# EAGLE design dac2 (EAGLE 5.06)
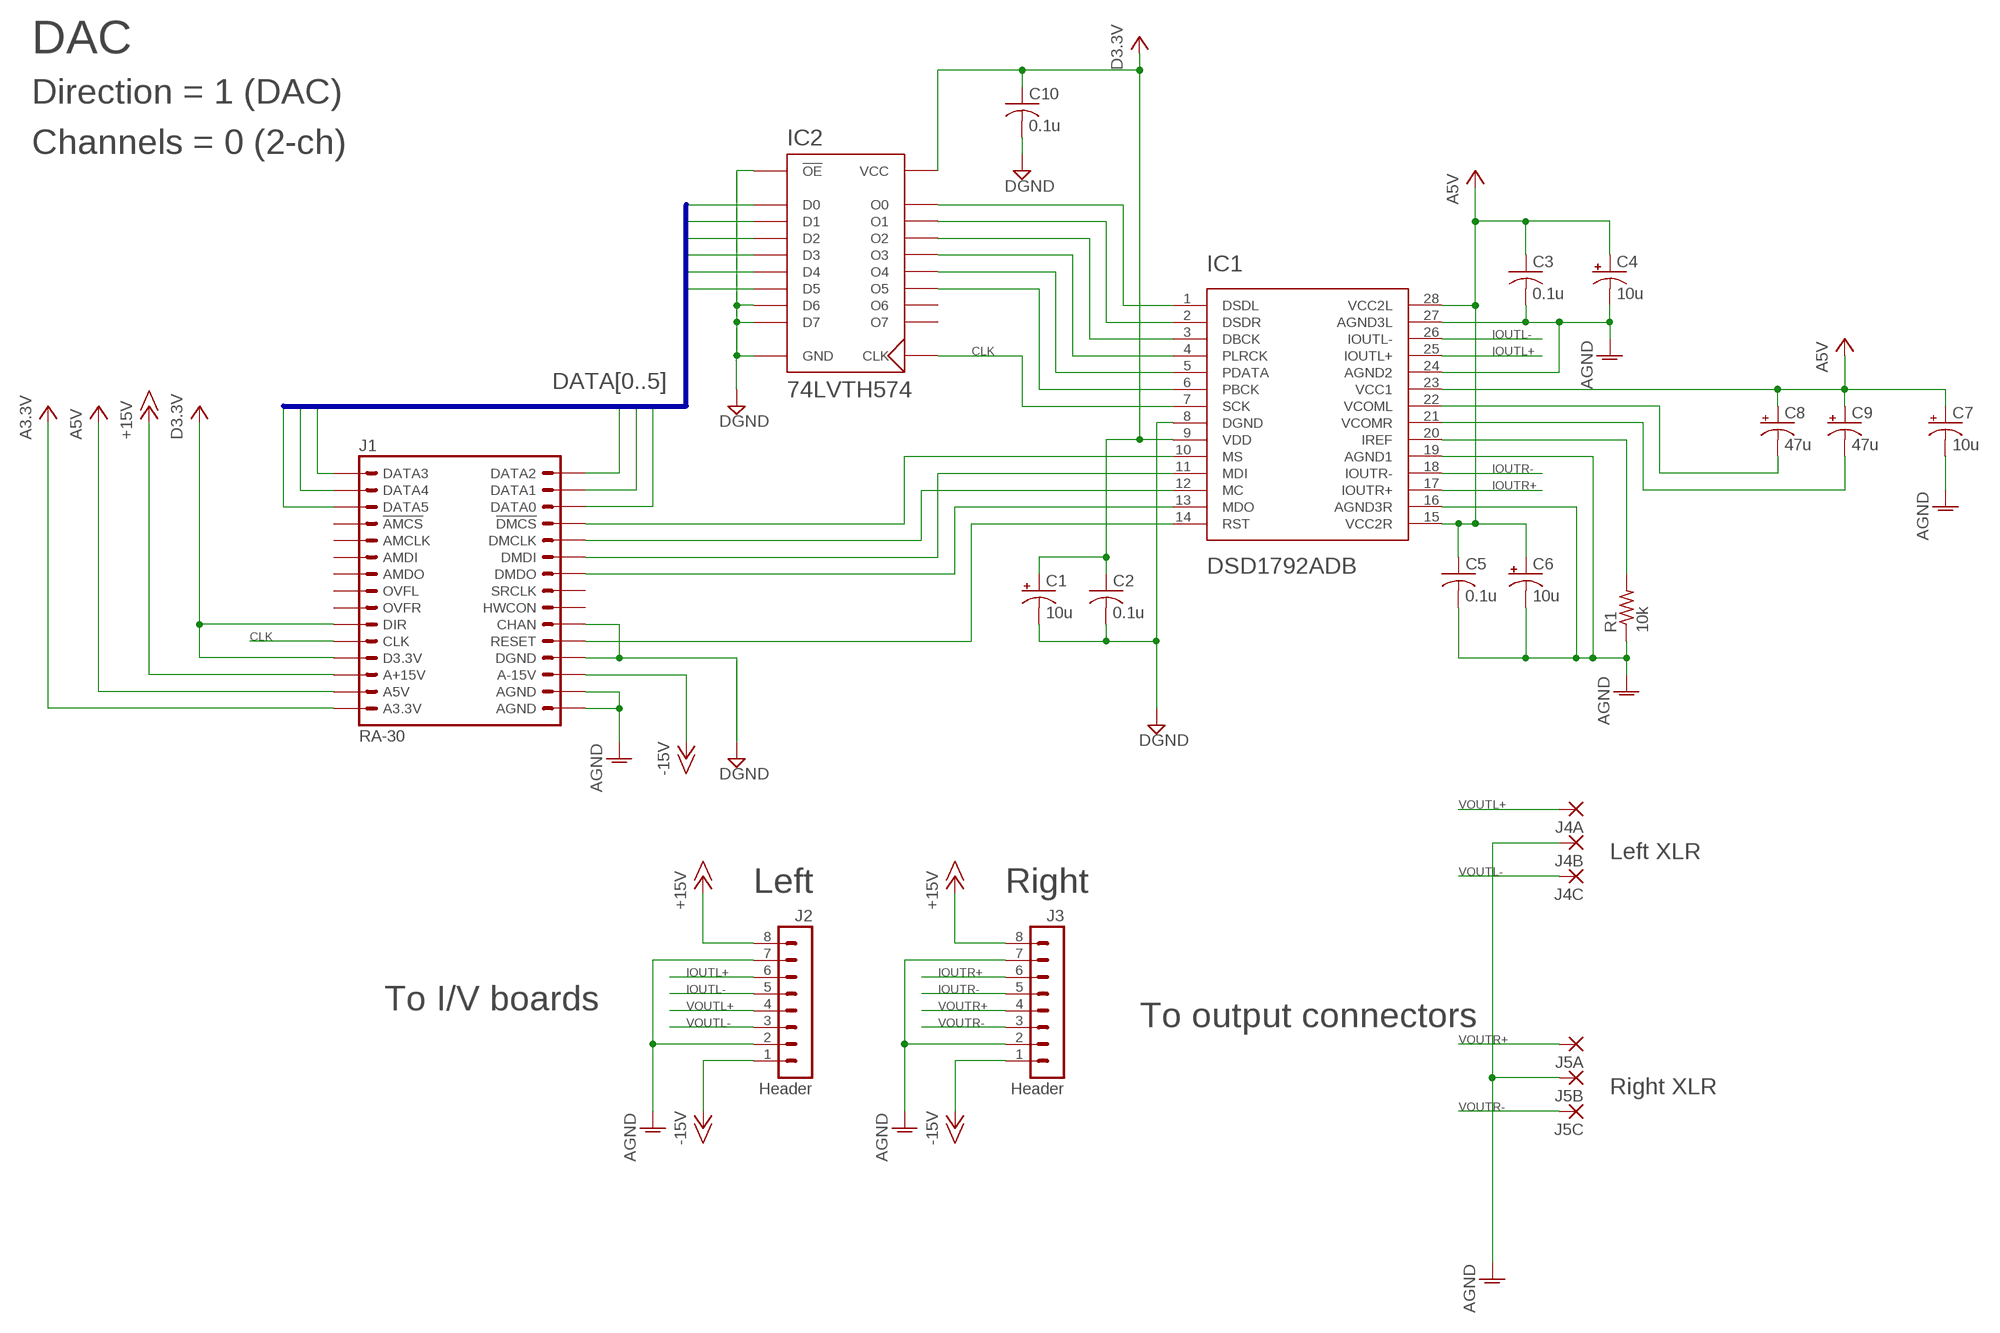
[diagram p0: schematic, sheet 1]

## Parts
C1  10u  CPOL-USC/6032-28R  [C/6032-28R]
C2  0.1u  C-USC1206  [C1206]
C3  0.1u  C-USC1206  [C1206]
C4  10u  CPOL-USC/6032-28R  [C/6032-28R]
C5  0.1u  C-USC1206  [C1206]
C6  10u  CPOL-USC/6032-28R  [C/6032-28R]
C7  10u  CPOL-USC/6032-28R  [C/6032-28R]
C8  47u  CPOL-US153CLV-0405  [153CLV-0405]
C9  47u  CPOL-US153CLV-0405  [153CLV-0405]
C10  0.1u  C-USC1206  [C1206]
IC1  DSD1792ADB  [SSOP28]
IC2  74LVTH574  [TSSOP20]
J1  RA-30  [FCI-RA-30]
J2  Header  MA08-1  [MA08-1]
J3  Header  MA08-1  [MA08-1]
J4A  2,54/1,1  [2,54/1,1]
J4B  2,54/1,1  [2,54/1,1]
J4C  2,54/1,1  [2,54/1,1]
J5A  2,54/1,1  [2,54/1,1]
J5B  2,54/1,1  [2,54/1,1]
J5C  2,54/1,1  [2,54/1,1]
R1  10k  R-US_R1206  [R1206]

## Nets
+15V: J1.P$A28(A+15V) J2.8 J3.8
-15V: J1.P$A3(A-15V) J2.1 J3.1
A3.3V: J1.P$A30(A3.3V)
A5V: C3.1 C4.+ C5.1 C6.+ C7.+ C8.+ C9.+ IC1.15(VCC2R) IC1.23(VCC1) IC1.28(VCC2L) J1.P$A29(A5V)
AGND: C3.2 C4.- C5.2 C6.- C7.- IC1.16(AGND3R) IC1.19(AGND1) IC1.24(AGND2) IC1.27(AGND3L) J1.P$A1(AGND) J1.P$A2(AGND) J2.2 J2.7 J3.2 J3.7 J4B.1(P) J5B.1(P) R1.1
CLK: IC1.7(SCK) IC2.11(CLK) J1.P$A26(CLK)
D3.3V: C1.+ C2.1 C10.1 IC1.9(VDD) IC2.20(VCC) J1.P$A25(DIR) J1.P$A27(D3.3V)
DATA0: IC2.2(D0) J1.P$A13(DATA0)
DATA1: IC2.3(D1) J1.P$A14(DATA1)
DATA2: IC2.4(D2) J1.P$A15(DATA2)
DATA3: IC2.5(D3) J1.P$A16(DATA3)
DATA4: IC2.6(D4) J1.P$A17(DATA4)
DATA5: IC2.7(D5) J1.P$A18(DATA5)
DGND: C1.- C2.2 C10.2 IC1.8(DGND) IC2.1(!OE) IC2.8(D6) IC2.9(D7) IC2.10(GND) J1.P$A4(DGND) J1.P$A6(CHAN)
IOUTL+: IC1.25(IOUTL+) J2.6
IOUTL-: IC1.26(IOUTL-) J2.5
IOUTR+: IC1.17(IOUTR+) J3.6
IOUTR-: IC1.18(IOUTR-) J3.5
N$1: IC1.14(RST) J1.P$A5(RESET)
N$2: IC1.13(MDO) J1.P$A9(DMDO)
N$3: IC1.11(MDI) J1.P$A10(DMDI)
N$4: IC1.12(MC) J1.P$A11(DMCLK)
N$5: IC1.10(MS) J1.P$A12(!DMCS)
N$6: IC1.1(DSDL) IC2.19(O0)
N$7: IC1.2(DSDR) IC2.18(O1)
N$8: IC1.3(DBCK) IC2.17(O2)
N$9: IC1.4(PLRCK) IC2.16(O3)
N$10: IC1.5(PDATA) IC2.15(O4)
N$11: IC1.6(PBCK) IC2.14(O5)
N$12: IC1.20(IREF) R1.2
N$14: C8.- IC1.22(VCOML)
N$15: C9.- IC1.21(VCOMR)
VOUTL+: J2.4 J4A.1(P)
VOUTL-: J2.3 J4C.1(P)
VOUTR+: J3.4 J5A.1(P)
VOUTR-: J3.3 J5C.1(P)
Unconnected: IC2.12(O7) IC2.13(O6) J1.P$A7(HWCON) J1.P$A8(SRCLK) J1.P$A19(!AMCS) J1.P$A20(AMCLK) J1.P$A21(AMDI) J1.P$A22(AMDO) J1.P$A23(OVFL) J1.P$A24(OVFR)

## Buses
DATA[0..5]

## Notes on the sheet
- DAC
- Direction = 1 (DAC)
- Channels = 0 (2-ch)
- Left XLR
- Left | Right
- To I/V boards
- To output connectors
- Right XLR

## Library data of the parts
C1 C4 C6-C9 = rcl:CPOL-US: POLARIZED CAPACITOR, American symbol
C2 C3 C5 C10 = rcl:C-US: CAPACITOR, American symbol
IC1 = cdp:DSD1792A
IC2 = cdp:74LVTH574
J1 = cdp:RA-30
J2 J3 = con-lstb:MA08-1: PIN HEADER
J4A J4B J4C J5A J5B J5C = wirepad:2,54/1,1: THROUGH-HOLE PAD
R1 = rcl:R-US_: RESISTOR, American symbol

## Board
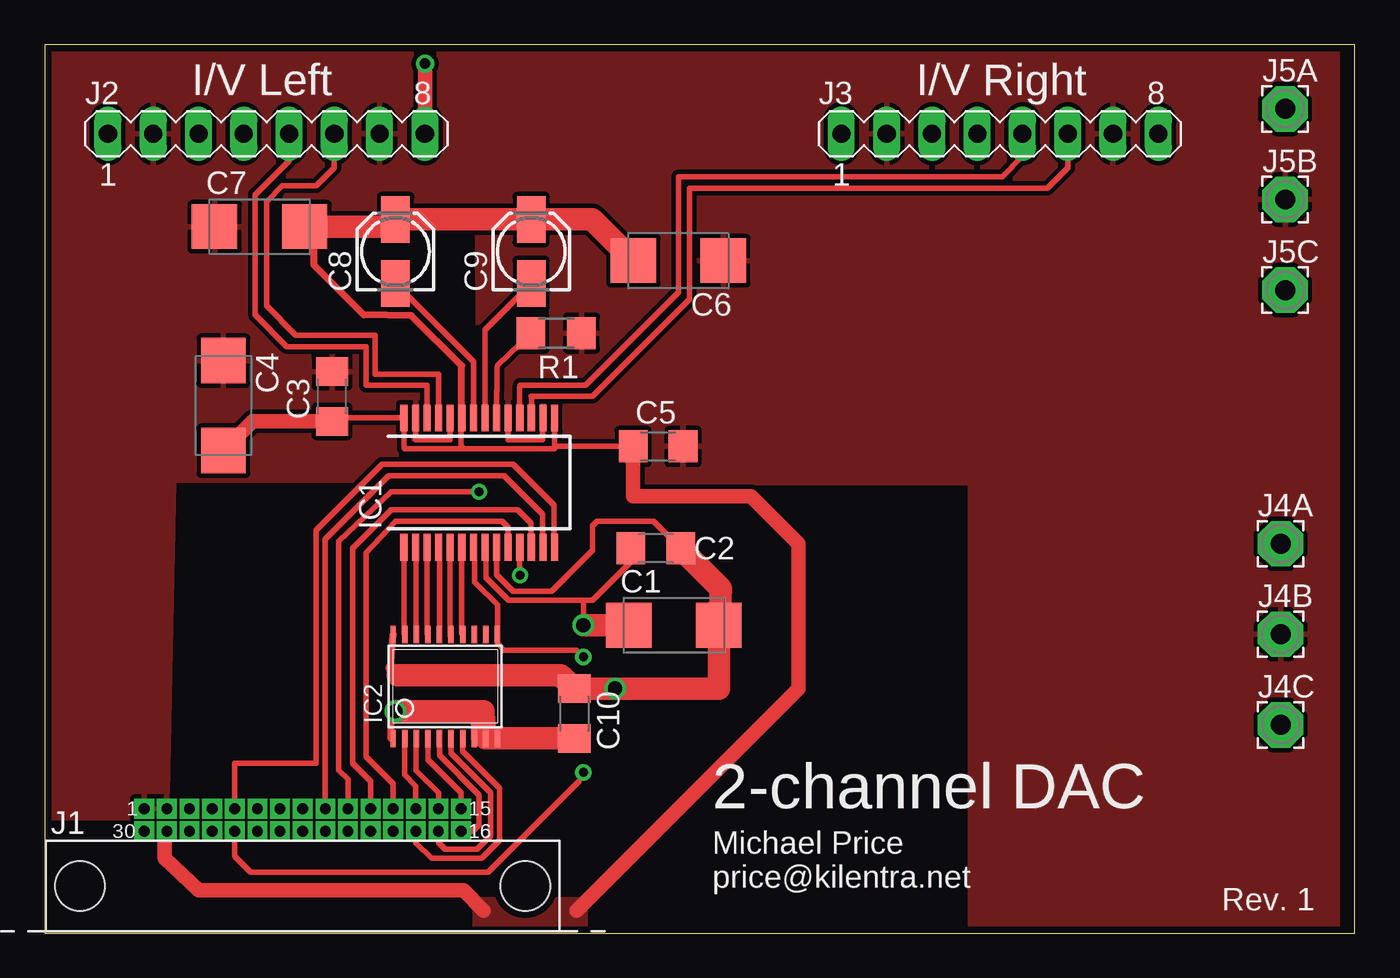
[diagram p1: board, top side]
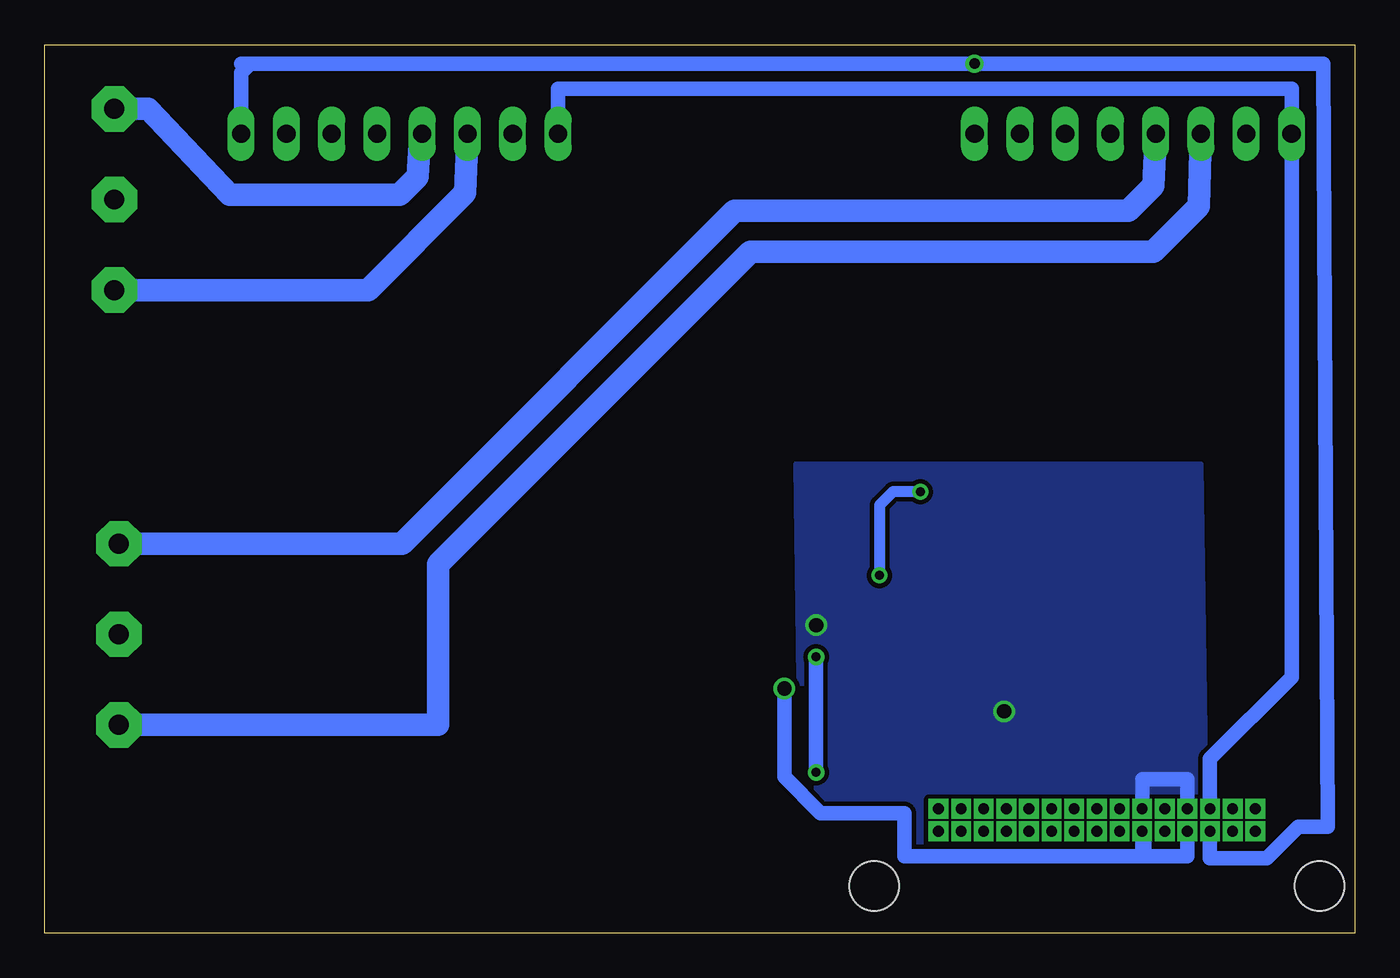
[diagram p2: board, bottom side, seen from below]

Size 73.51 x 49.84 mm. Coordinates in mm from the lower left corner, seen from the top.
Outline: 0,0 73.51,0 73.51,49.84 0,49.84 0,0
Copper layers (1*16): Top 0.035mm / dielectric 1.5mm / Bottom 0.035mm
Design rules "6mils": minimum track width 10mil, minimum drill 15mil, track to track 6mil, track to pad 6mil, pad to pad 6mil, via to via 6mil, smd to smd 6mil, copper to edge 15mil, drill to drill 8mil, minimum pad ring 10mil, minimum via ring 8mil, stop-mask expansion 4mil, vias tented up to drill 0mil, thermal gap 10mil

### Footprints (pad centres in the part's own frame; a part is rotated, then mirrored left to right if it is on the bottom)
C/6032-28R = smd 2.55 x 2.5: + 2.525,0; - -2.525,0
C1206 = smd 1.6 x 1.8: 1 -1.4,0; 2 1.4,0
153CLV-0405 = smd 2.6 x 1.6: + 1.8,0; - -1.8,0
SSOP28 = smd 0.4 x 1.5: 1 -4.225,-3.625; 2 -3.575,-3.625; 3 -2.925,-3.625; 4 -2.275,-3.625; 5 -1.625,-3.625; 6 -0.975,-3.625; 7 -0.325,-3.625; 8 0.325,-3.625; 9 0.975,-3.625; 10 1.625,-3.625; 11 2.275,-3.625; 12 2.925,-3.625; 13 3.575,-3.625; 14 4.225,-3.625; 15 4.225,3.625; 16 3.575,3.625; 17 2.925,3.625; 18 2.275,3.625; 19 1.625,3.625; 20 0.975,3.625; 21 0.325,3.625; 22 -0.325,3.625; 23 -0.975,3.625; 24 -1.625,3.625; 25 -2.275,3.625; 26 -2.925,3.625; 27 -3.575,3.625; 28 -4.225,3.625
TSSOP20 = smd 0.305 x 0.991: 1 -2.925,-2.918; 2 -2.275,-2.918; 3 -1.625,-2.918; 4 -0.975,-2.918; 5 -0.325,-2.918; 6 0.325,-2.918; 7 0.975,-2.918; 8 1.625,-2.918; 9 2.275,-2.918; 10 2.925,-2.918; 11 2.925,2.918; 12 2.275,2.918; 13 1.625,2.918; 14 0.975,2.918; 15 0.325,2.918; 16 -0.325,2.918; 17 -0.975,2.918; 18 -1.625,2.918; 19 -2.275,2.918; 20 -2.925,2.918
FCI-RA-30 = drill 0.6 pad 0.813 square: P$A1 -8.89,0.635; P$A2 -7.62,0.635; P$A3 -6.35,0.635; P$A4 -5.08,0.635; P$A5 -3.81,0.635; P$A6 -2.54,0.635; P$A7 -1.27,0.635; P$A8 0,0.635; P$A9 1.27,0.635; P$A10 2.54,0.635; P$A11 3.81,0.635; P$A12 5.08,0.635; P$A13 6.35,0.635; P$A14 7.62,0.635; P$A15 8.89,0.635; P$A16 8.89,-0.635; P$A17 7.62,-0.635; P$A18 6.35,-0.635; P$A19 5.08,-0.635; P$A20 3.81,-0.635; P$A21 2.54,-0.635; P$A22 1.27,-0.635; P$A23 0,-0.635; P$A24 -1.27,-0.635; P$A25 -2.54,-0.635; P$A26 -3.81,-0.635; P$A27 -5.08,-0.635; P$A28 -6.35,-0.635; P$A29 -7.62,-0.635; P$A30 -8.89,-0.635 | hole 2.8: -12.497,-3.708; 12.497,-3.708
MA08-1 = drill 1.016 long: 1 -8.89,0; 2 -6.35,0; 3 -3.81,0; 4 -1.27,0; 5 1.27,0; 6 3.81,0; 7 6.35,0; 8 8.89,0
2,54/1,1 = drill 1.118 pad 2.54 octagon: 1 0,0
R1206 = smd 1.6 x 1.803: 1 -1.422,0; 2 1.422,0

### Placement (x,y rotation side)
C1  35.31,17.27 0 top
C2  34.29,21.59 180 top
C3  16.13,30.1 90 top
C4  10.03,29.59 270 top
C5  34.42,27.3 0 top
C6  35.56,37.72 180 top
C7  12.06,39.62 0 top
C8  19.68,38.23 90 top
C9  27.3,38.23 90 top
C10  29.72,12.32 270 top
IC1  24.38,25.27 0 top
IC2  22.48,13.84 0 top
J1  14.48,6.35 0 top
J2  12.45,44.83 0 top
J3  53.59,44.83 0 top
J4A  69.34,21.84 0 top
J4B  69.34,16.76 0 top
J4C  69.34,11.68 0 top
J5A  69.6,46.23 0 top
J5B  69.6,41.15 0 top
J5C  69.6,36.07 0 top
R1  28.7,33.66 180 top

### Tracks (layer width: path | path; a pad name or v marks a point on that pad's centre or on a via)
+15V  (via drill 0.6)
  Top 0.813: v21.34,48.77 J2.8
  Bottom 0.813: J1.P$A28 8.13,4.19 4.95,4.19 3.17,5.97 1.52,5.97 1.78,48.77 v21.34,48.77 61.98,48.77 | 61.98,48.77 62.48,48.77 | J3.8 62.48,48.26 61.98,48.77
-15V
  Bottom 0.813: J1.P$A3 8.13,9.78 3.56,14.35 J2.1 3.56,47.37 44.58,47.37 | 44.58,47.37 44.7,47.37 | J3.1 44.7,47.24 44.58,47.37
A5V
  Top 0.305: 28.57,29.28 IC1.15 28.61,27.18 | 15.37,28.7 C3.1 16.13,28.9 IC1.28 20.16,27.21 20.19,27.18 23.5,27.18 | 28.61,27.18 23.5,27.18 | IC1.23 23.37,28.9 23.37,27.3 23.5,27.18 | C5.1 28.61,27.3 28.61,27.18
  Top 0.406: IC1.23 23.41,31.84 20.57,34.63 17.91,34.67 15.11,37.47 15.11,39.62
  Top 0.813: C4.+ 11.67,28.7 15.37,28.7 | J1.P$A29 6.73,5.59 6.73,4.19 8.64,2.41 23.5,2.41 24.64,1.27 | 29.84,1.27 42.29,13.72 42.29,21.84 39.62,24.51 33.02,24.51 C5.1
  Top 1.27: C6.+ 30.73,40.03 C9.+ C8.+ 19.28,39.62 15.11,39.62 C7.+
  pour Top: 24.13,1.91 30.35,1.91 30.35,0.13 24.13,0.13
AGND
  Top 0.305: IC1.16 27.94,28.9 27.94,27.69 26.01,27.69 IC1.19 | IC1.27 20.83,28.9 20.83,27.69 22.76,27.69 IC1.24
  pour Top (isolate 0.254): 0.25,6.48 6.86,6.48 7.24,25.4 21.08,25.4 21.08,40.77 24.26,40.77 24.38,29.59 27.3,29.59 31.5,25.27 51.94,25.27 51.94,0.25 72.52,0.25 72.52,52.96 0.51,52.96
CLK  (via drill 0.5 pad 0.25)
  Top 0.305: IC1.7 24.13,21.96 24.13,19.68 25.4,18.41 IC2.11 25.4,16.25 25.78,15.88 29.84,15.88 v30.23,15.49 | v30.23,9.02 29.97,8.51 24.89,3.43 11.56,3.43 10.67,4.32 J1.P$A26
  Bottom 0.813: v30.23,9.02 v30.23,15.49
D3.3V  (via drill 0.8 pad 0.25)
  Top 0.305: C10.1 | 37.85,13.72 37.83,13.73 | IC1.9 25.36,20.11 26.29,19.18 28.45,19.18 30.73,21.46 30.73,22.86 30.99,23.11 34.17,23.11 C2.1
  Top 0.406: 19.43,14.86 IC2.20
  Top 0.61: 19.81,14.48 19.43,14.86
  Top 1.27: C10.1 28.96,14.48 19.81,14.48 | C10.1 v32,13.72 37.85,13.72 | 37.83,13.73 C1.+ 37.96,19.32 C2.1
  Bottom 0.813: 11.94,4.32 J1.P$A25 11.81,5.71 11.81,4.32 11.94,4.32 | 11.94,4.32 9.4,4.32 J1.P$A27 | 11.94,4.32 25.27,4.32 25.27,6.73 29.97,6.73 32,8.76 v32,13.72
DATA0
  Top 0.305: J1.P$A13 20.83,8.26 20.2,8.88 IC2.2
DATA1
  Top 0.305: J1.P$A14 22.1,7.87 20.85,9.12 IC2.3
DATA2
  Top 0.305: J1.P$A15 23.37,7.87 21.5,9.74 IC2.4
DATA3
  Top 0.305: IC2.5 22.15,9.98 24.38,7.75 24.38,6.1 24,5.71 J1.P$A16
DATA4
  Top 0.305: IC2.6 22.8,10.09 25.02,7.87 25.02,5.46 24.26,4.7 22.48,4.7 22.1,5.08 J1.P$A17
DATA5
  Top 0.305: IC2.7 23.45,10.2 25.53,8.13 25.53,5.21 24.51,4.19 21.72,4.19 20.83,5.08 J1.P$A18
DGND  (via drill 0.8 pad 0.25)
  Top 0.305: IC1.8 24.77,21.59 24.77,19.94 26.04,18.67 30.73,18.67 | 30.73,18.67 32.89,20.82 C2.2 | 30.73,18.67 30.23,18.67 v30.23,17.27 | 19.43,10.93 IC2.1
  Top 0.406: v19.68,12.45 19.68,12.19 19.43,11.94 19.43,10.93 | IC2.8 24.1,12.42 24,12.45
  Top 1.27: C10.2 IC2.10 IC2.9 24.63,12.31 24.64,12.32 24.64,12.45 24,12.45 v19.68,12.45 | v30.23,17.27 C1.-
  Bottom 0.813: J1.P$A4 9.4,8.64 11.94,8.64 J1.P$A6
  pour Bottom (isolate 0.254): 8.26,0 30.99,0 31.37,26.29 8.64,26.29
IOUTL+
  Top 0.305: IC1.25 22.11,31.36 18.54,31.36 18.54,33.53 14.1,33.53 12.45,35.18 12.45,41.02 13.34,41.91 15.24,41.91 16.26,42.93 J2.6
IOUTL-
  Top 0.305: IC1.26 21.46,30.74 18.03,30.73 18.03,32.89 13.59,32.89 11.81,34.67 11.81,41.4 13.72,43.31 J2.5
IOUTR+
  Top 0.305: IC1.17 27.31,30.09 27.3,30.1 30.73,30.1 36.2,35.56 36.2,41.78 56.26,41.78 57.4,42.93 J3.6
IOUTR-
  Top 0.305: IC1.18 26.66,30.6 26.67,30.73 30.35,30.73 35.56,35.94 35.56,42.42 53.72,42.42 54.86,43.56 J3.5
N$1
  Top 0.305: J1.P$A5 10.67,9.53 15.24,9.53 15.24,22.61 18.92,26.29 26.29,26.29 28.57,24 28.57,21.68 IC1.14
N$2
  Top 0.305: J1.P$A9 15.75,22.1 19.3,25.65 25.78,25.65 27.94,23.5 27.94,21.67 IC1.13
N$3  (via drill 0.5 pad 0.25)
  Top 0.305: J1.P$A10 17.02,8.64 16.51,9.14 16.51,21.97 19.43,24.77 v24.38,24.77 | IC1.11 26.66,20.08 v26.67,20.07
  Bottom 0.61: v24.38,24.77 25.91,24.77 26.67,24 v26.67,20.07
N$4
  Top 0.305: J1.P$A11 18.29,8.51 17.27,9.53 17.27,21.59 19.43,23.75 26.54,23.75 27.3,22.99 IC1.12
N$5
  Top 0.305: IC1.10 26.01,22.76 25.65,23.11 19.68,23.11 18.03,21.34 18.03,9.91 19.56,8.38 J1.P$A12
N$6
  Top 0.305: IC2.19 20.16,16.81 IC1.1
N$7
  Top 0.305: IC1.2 20.85,21.98 IC2.18
N$8
  Top 0.305: IC2.17 21.46,16.81 IC1.3
N$9
  Top 0.305: IC1.4 22.15,21.98 IC2.16
N$10
  Top 0.305: IC2.15 22.76,16.68 IC1.5
N$11
  Top 0.305: IC2.14 23.41,16.81 IC1.6
N$12
  Top 0.305: 25.36,28.36 IC1.20 25.36,30.41 25.4,30.45 25.4,31.75 25.43,31.85 R1.2
N$14
  Top 0.305: IC1.22 24.06,32.05 C8.-
N$15
  Top 0.305: IC1.21 24.71,33.83 C9.-
VOUTL+
  Bottom 1.27: J4A.1 53.47,21.84 34.8,40.51 12.7,40.51 11.3,41.91 J2.4
VOUTL-
  Bottom 1.27: J2.3 8.76,40.77 11.3,38.23 33.91,38.23 51.44,20.7 51.44,11.68 J4C.1
VOUTR+
  Bottom 1.27: J5A.1 67.69,46.23 63.12,41.4 53.59,41.4 52.58,42.42 52.45,44.7 J3.4
VOUTR-
  Bottom 1.27: J5C.1 55.37,36.07 49.91,41.53 J3.3

### Text on the board
tPlace: I/V Left | I/V Right | 2-channel DAC | Michael Price | price@kilentra.net | Rev. 1